# EAGLE design Main Flight Computer (EAGLE 9.0.1)
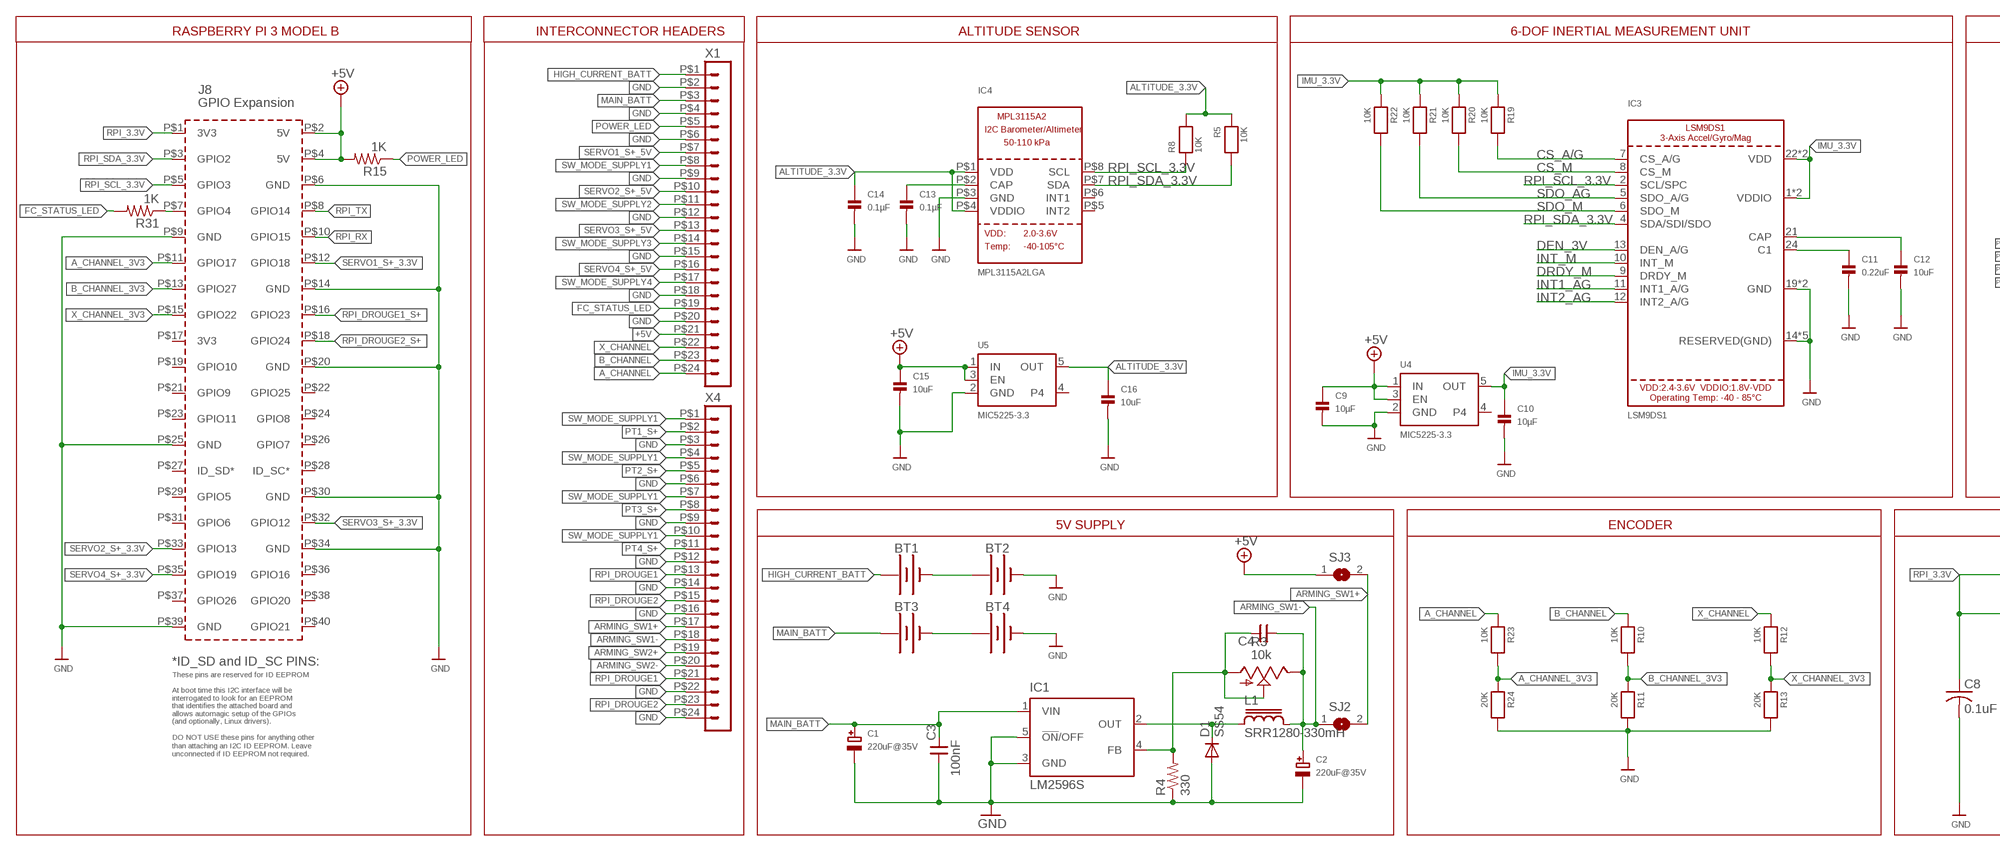
[diagram p0: schematic, sheet 1, part 1 of 2]
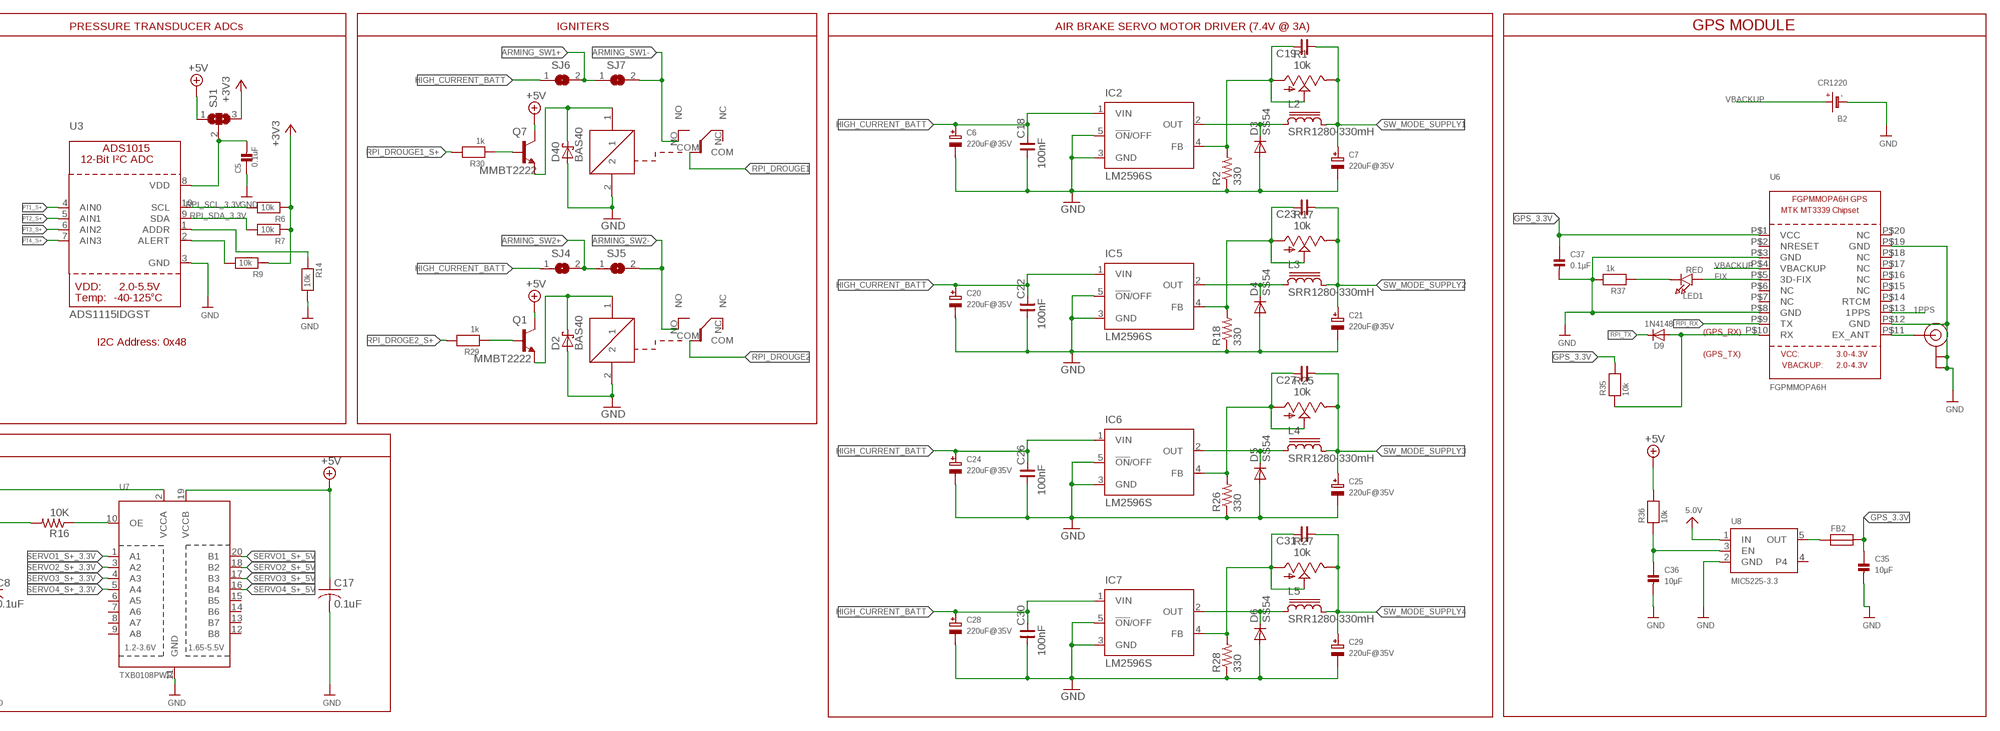
[diagram p1: schematic, sheet 1, part 2 of 2]

## Parts
B2  CR1220  BATTERYCR1220_SMT  [CR1220]
BT1  BATTERY-18650  [BATTERY_18650-HOLDER]
BT2  BATTERY-18650  [BATTERY_18650-HOLDER]
BT3  BATTERY-18650  [BATTERY_18650-HOLDER]
BT4  BATTERY-18650  [BATTERY_18650-HOLDER]
C1  220uF@35V  CAP_ELECTROLYTICPANASONIC_D  [PANASONIC_D]
C2  220uF@35V  CAP_ELECTROLYTICPANASONIC_D  [PANASONIC_D]
C3  100nF  CNP-0603  [0603]
C4  CNP-0603  [0603]
C5  0.1uF  CAP_CERAMIC0805  [0805]
C6  220uF@35V  CAP_ELECTROLYTICPANASONIC_D  [PANASONIC_D]
C7  220uF@35V  CAP_ELECTROLYTICPANASONIC_D  [PANASONIC_D]
C8  0.1uF  C-USC0805  [C0805]
C9  10µF  CAP_CERAMIC0603  [0603]
C10  10µF  CAP_CERAMIC0603  [0603]
C11  0.22uF  CAP_CERAMIC0603  [0603]
C12  10uF  CAP_CERAMIC0603  [0603]
C13  0.1µF  CAP_CERAMIC0603  [0603]
C14  0.1µF  CAP_CERAMIC0603  [0603]
C15  10uF  CAP_CERAMIC0603  [0603]
C16  10uF  CAP_CERAMIC0603  [0603]
C17  0.1uF  C-USC0805  [C0805]
C18  100nF  CNP-0603  [0603]
C19  CNP-0603  [0603]
C20  220uF@35V  CAP_ELECTROLYTICPANASONIC_D  [PANASONIC_D]
C21  220uF@35V  CAP_ELECTROLYTICPANASONIC_D  [PANASONIC_D]
C22  100nF  CNP-0603  [0603]
C23  CNP-0603  [0603]
C24  220uF@35V  CAP_ELECTROLYTICPANASONIC_D  [PANASONIC_D]
C25  220uF@35V  CAP_ELECTROLYTICPANASONIC_D  [PANASONIC_D]
C26  100nF  CNP-0603  [0603]
C27  CNP-0603  [0603]
C28  220uF@35V  CAP_ELECTROLYTICPANASONIC_D  [PANASONIC_D]
C29  220uF@35V  CAP_ELECTROLYTICPANASONIC_D  [PANASONIC_D]
C30  100nF  CNP-0603  [0603]
C31  CNP-0603  [0603]
C35  10µF  CAP_CERAMIC0603  [0603]
C36  10µF  CAP_CERAMIC0603  [0603]
C37  0.1µF  CAP_CERAMIC0603  [0603]
D1  SS54  S3G  [DO214AB]
D2  BAS40  [SOT23]
D3  SS54  S3G  [DO214AB]
D4  SS54  S3G  [DO214AB]
D5  SS54  S3G  [DO214AB]
D6  SS54  S3G  [DO214AB]
D9  1N4148  DIODESOD-323  [SOD-323]
D40  BAS40  [SOT23]
FB2  FERRITE  [0603]
IC1  LM2596S  [TO263-5]
IC2  LM2596S  [TO263-5]
IC3  LSM9DS1  [LGA24_3.5X3.1MM]
IC4  MPL3115A2LGA  [LGA8]
IC5  LM2596S  [TO263-5]
IC6  LM2596S  [TO263-5]
IC7  LM2596S  [TO263-5]
L1  SRR1280-330mH  SRR1280  [SRR1280]
L2  SRR1280-330mH  SRR1280  [SRR1280]
L3  SRR1280-330mH  SRR1280  [SRR1280]
L4  SRR1280-330mH  SRR1280  [SRR1280]
L5  SRR1280-330mH  SRR1280  [SRR1280]
LED1  RED  LED0805  [CHIPLED_0805]
PCB1  RPI3  [RPI3]
Q1  MMBT2222  TRANSISTOR_NPN  [SOT223]
Q7  MMBT2222  TRANSISTOR_NPN  [SOT223]
R1  10k  TRIM_US-S64W  [S64W]
R2  330  R-US_R0603  [R0603]
R3  10k  TRIM_US-S64W  [S64W]
R4  330  R-US_R0603  [R0603]
R5  10K  RESISTOR0603  [0603]
R6  10k  RESISTOR0805  [0805]
R7  10k  RESISTOR0805  [0805]
R8  10K  RESISTOR0603  [0603]
R9  10k  RESISTOR0805  [0805]
R10  10K  RESISTOR0603  [0603]
R11  20K  RESISTOR0603  [0603]
R12  10K  RESISTOR0603  [0603]
R13  20K  RESISTOR0603  [0603]
R14  10k  RESISTOR0805  [0805]
R15  1K  R-US_R0603  [R0603]
R16  10K  R-US_R0805  [R0805]
R17  10k  TRIM_US-S64W  [S64W]
R18  330  R-US_R0603  [R0603]
R19  10K  RESISTOR0603  [0603]
R20  10K  RESISTOR0603  [0603]
R21  10K  RESISTOR0603  [0603]
R22  10K  RESISTOR0603  [0603]
R23  10K  RESISTOR0603  [0603]
R24  20K  RESISTOR0603  [0603]
R25  10k  TRIM_US-S64W  [S64W]
R26  330  R-US_R0603  [R0603]
R27  10k  TRIM_US-S64W  [S64W]
R28  330  R-US_R0603  [R0603]
R29  1k  RESISTOR0603  [0603]
R30  1k  RESISTOR0603  [0603]
R31  1K  R-US_R0603  [R0603]
R35  10k  RESISTOR0603  [0603]
R36  10k  RESISTOR0603  [0603]
R37  1k  RESISTOR0603  [0603]
SJ1  SJ2W  [SJ_2]
SJ2  SJ  [SJ]
SJ3  SJ  [SJ]
SJ4  SJ  [SJ]
SJ5  SJ  [SJ]
SJ6  SJ  [SJ]
SJ7  SJ  [SJ]
U3  ADS1115IDGST  ADC_ADS1015  [MSOP10]
U4  MIC5225-3.3  VREG_SOT23-5  [SOT23-5]
U5  MIC5225-3.3  VREG_SOT23-5  [SOT23-5]
U6  FGPMMOPA6H  GPS_FGPMMOPA6H  [FGPMMOPA6H]
U7  TXB0108PWR  [TSSOP20]
U8  MIC5225-3.3  VREG_SOT23-5  [SOT23-5]
U$2  U.FL  [U.FL]
U$11  RW-SH  [RW-SH]
U$13  RW-SH  [RW-SH]
X1  HEADER_POS24_44914-2401  [44914-2401]
X4  HEADER_POS24_44914-2401  [44914-2401]

## Nets
1PPS: U6.P$13(1PPS)
5.0V: U8.1(IN)
+3V3: R6.1 R7.1 R9.1 SJ1.3
+5V: C9.1 C15.1 C17.1 PCB1.P$2(5V) PCB1.P$4(5V) Q1.2(C) Q7.2(C) R15.2 R36.2 SJ1.1 SJ3.1 U4.1(IN) U4.3(EN) U5.1(IN) U5.3(EN) U7.19(VCCB) X1.P$21
A_CHANNEL: R23.1 X1.P$24
A_CHANNEL_3V3: PCB1.P$11(GPIO17) R23.2 R24.1
ALTITUDE_3.3V: C14.1 C16.1 IC4.P$1(VDD) IC4.P$4(VDDIO) R5.1 R8.2 U5.5(OUT)
ARMING_SW1+: SJ2.2 SJ3.2 SJ6.2 SJ7.1 X4.P$17
ARMING_SW1-: C2.+ C4.1 L1.2 R3.E SJ2.1 SJ7.2 U$11.NO X4.P$18
ARMING_SW2+: SJ4.2 SJ5.1 X4.P$19
ARMING_SW2-: SJ5.2 U$13.NO X4.P$20
B_CHANNEL: R10.1 X1.P$23
B_CHANNEL_3V3: PCB1.P$13(GPIO27) R10.2 R11.1
C2: C11.1 IC3.24(C1)
CAP1: C12.1 IC3.21(CAP)
CAP2: C13.1 IC4.P$2(CAP)
CS_A/G: IC3.7(CS_A/G) R19.2
CS_M: IC3.8(CS_M) R20.2
DEN_3V: IC3.13(DEN_A/G)
DRDY_M: IC3.9(DRDY_M)
FC_STATUS_LED: R31.2 X1.P$19
FIX: LED1.A U6.P$5(3D-FIX)
GND: B2.- BT2.GND@1(-) BT4.GND@1(-) C1.- C2.- C3.1 C5.1 C6.- C7.- C8.2 C9.2 C10.2 C11.2 C12.2 C13.2 C14.2 C15.2 C16.2 C17.2 C18.1 C20.- C21.- C22.1 C24.- C25.- C26.1 C28.- C29.- C30.1 C35.2 C36.2 C37.2 D1.A D2.1(A) D3.A D4.A D5.A D6.A D40.1(A) IC1.3(GND) IC1.5(!ON!/OFF) IC2.3(GND) IC2.5(!ON!/OFF) IC3.14(RESERVED(GND)) IC3.15(RESERVED(GND)) IC3.16(RESERVED(GND)) IC3.17(RESERVED(GND)) IC3.18(RESERVED(GND)) IC3.19(GND) IC3.20(GND) IC4.P$3(GND) IC5.3(GND) IC5.5(!ON!/OFF) IC6.3(GND) IC6.5(!ON!/OFF) IC7.3(GND) IC7.5(!ON!/OFF) PCB1.P$6(GND) PCB1.P$9(GND) PCB1.P$14(GND) PCB1.P$20(GND) PCB1.P$25(GND) PCB1.P$30(GND) PCB1.P$34(GND) PCB1.P$39(GND) R2.1 R4.1 R11.2 R13.2 R14.2 R18.1 R24.2 R26.1 R28.1 R37.2 U3.3(GND) U4.2(GND) U5.2(GND) U6.P$3(GND) U6.P$8(GND) U6.P$12(GND) U6.P$19(GND) U7.11(GND) U8.2(GND) U$2.P$1(GND) U$2.P$2(GND) U$11.2 U$13.2 X1.P$2 X1.P$4 X1.P$6 X1.P$9 X1.P$12 X1.P$15 X1.P$18 X1.P$20 X4.P$3 X4.P$6 X4.P$9 X4.P$12 X4.P$14 X4.P$16 X4.P$22 X4.P$24
GPS_3.3V: C35.1 C37.1 FB2.2 R35.2 U6.P$1(VCC)
HIGH_CURRENT_BATT: BT1.PWR@1(+) C6.+ C18.2 C20.+ C22.2 C24.+ C26.2 C28.+ C30.2 IC2.1(VIN) IC5.1(VIN) IC6.1(VIN) IC7.1(VIN) SJ4.1 SJ6.1 X1.P$1
IMU_3.3V: C10.1 IC3.1(VDDIO) IC3.3(VDDIO) IC3.22(VDD) IC3.23(VDD) R19.1 R20.1 R21.1 R22.1 U4.5(OUT)
INT1_AG: IC3.11(INT1_A/G)
INT2_AG: IC3.12(INT2_A/G)
INT_M: IC3.10(INT_M)
MAIN_BATT: BT3.PWR@1(+) C1.+ C3.2 IC1.1(VIN) X1.P$3
N$1: C5.2 SJ1.2 U3.8(VDD)
N$2: D4.C IC5.2(OUT) L3.1
N$3: D1.C IC1.2(OUT) L1.1
N$4: C4.2 IC1.4(FB) R3.A R3.S R4.2
N$5: C23.2 IC5.4(FB) R17.A R17.S R18.2
N$6: R16.1 U7.10(OE)
N$7: D2.3(C) Q1.3(E) U$13.1
N$8: D3.C IC2.2(OUT) L2.1
N$9: C19.2 IC2.4(FB) R1.A R1.S R2.2
N$10: D5.C IC6.2(OUT) L4.1
N$11: Q1.1(B) R29.1
N$12: Q7.1(B) R30.1
N$13: PCB1.P$7(GPIO4) R31.1
N$16: C27.2 IC6.4(FB) R25.A R25.S R26.2
N$17: D6.C IC7.2(OUT) L5.1
N$18: C31.2 IC7.4(FB) R27.A R27.S R28.2
N$19: BT1.GND@1(-) BT2.PWR@1(+)
N$20: U6.P$11(EX_ANT) U$2.P$3(SIGNAL)
N$21: D9.A R35.1 U6.P$10(RX)
N$23: C36.1 R36.1 U8.3(EN)
N$24: LED1.C R37.1
N$38: R9.2 U3.2(ALERT)
N$41: R14.1 U3.1(ADDR)
N$43: BT3.GND@1(-) BT4.PWR@1(+)
N$128: D40.3(C) Q7.3(E) U$11.1
OUT: FB2.1 U8.5(OUT)
POWER_LED: R15.1 X1.P$5
PT1_S+: U3.4(AIN0) X4.P$2
PT2_S+: U3.5(AIN1) X4.P$5
PT3_S+: U3.6(AIN2) X4.P$8
PT4_S+: U3.7(AIN3) X4.P$11
RPI_3.3V: C8.1 PCB1.P$1(3V3) R16.2 U7.2(VCCA)
RPI_DROGE2_S+: R29.2
RPI_DROUGE1: U$11.COM X4.P$13 X4.P$21
RPI_DROUGE1_S+: PCB1.P$16(GPIO23) R30.2
RPI_DROUGE2: U$13.COM X4.P$15 X4.P$23
RPI_DROUGE2_S+: PCB1.P$18(GPIO24)
RPI_RX: PCB1.P$10(GPIO15) U6.P$9(TX)
RPI_SCL_3.3V: IC3.2(SCL/SPC) IC4.P$8(SCL) PCB1.P$5(GPIO3) R6.2 R8.1 U3.10(SCL)
RPI_SDA_3.3V: IC3.4(SDA/SDI/SDO) IC4.P$7(SDA) PCB1.P$3(GPIO2) R5.2 R7.2 U3.9(SDA)
RPI_TX: D9.C PCB1.P$8(GPIO14)
SDO_AG: IC3.5(SDO_A/G) R21.2
SDO_M: IC3.6(SDO_M) R22.2
SERVO1_S+_3.3V: PCB1.P$12(GPIO18) U7.1(A1)
SERVO1_S+_5V: U7.20(B1) X1.P$7
SERVO2_S+_3.3V: PCB1.P$33(GPIO13) U7.3(A2)
SERVO2_S+_5V: U7.18(B2) X1.P$10
SERVO3_S+_3.3V: PCB1.P$32(GPIO12) U7.4(A3)
SERVO3_S+_5V: U7.17(B3) X1.P$13
SERVO4_S+_3.3V: PCB1.P$35(GPIO19) U7.5(A4)
SERVO4_S+_5V: U7.16(B4) X1.P$16
SW_MODE_SUPPLY1: C7.+ C19.1 L2.2 R1.E X1.P$8 X4.P$1 X4.P$4 X4.P$7 X4.P$10
SW_MODE_SUPPLY2: C21.+ C23.1 L3.2 R17.E X1.P$11
SW_MODE_SUPPLY3: C25.+ C27.1 L4.2 R25.E X1.P$14
SW_MODE_SUPPLY4: C29.+ C31.1 L5.2 R27.E X1.P$17
VBACKUP: B2.+$1(+) B2.+$2(+) U6.P$4(VBACKUP)
X_CHANNEL: R12.1 X1.P$22
X_CHANNEL_3V3: PCB1.P$15(GPIO22) R12.2 R13.1
Unconnected: IC4.P$5(INT2) IC4.P$6(INT1) PCB1.P$17(3V3) PCB1.P$19(GPIO10) PCB1.P$21(GPIO9) PCB1.P$22(GPIO25) PCB1.P$23(GPIO11) PCB1.P$24(GPIO8) PCB1.P$26(GPIO7) PCB1.P$27(ID_SD*) PCB1.P$28(ID_SC*) PCB1.P$29(GPIO5) PCB1.P$31(GPIO6) PCB1.P$36(GPIO16) PCB1.P$37(GPIO26) PCB1.P$38(GPIO20) PCB1.P$40(GPIO21) U4.4 U5.4 U6.P$2(NRESET) U6.P$6(NC) U6.P$7(NC) U6.P$14(RTCM) U6.P$15(NC) U6.P$16(NC) U6.P$17(NC) U6.P$18(NC) U6.P$20(NC) U7.6(A5) U7.7(A6) U7.8(A7) U7.9(A8) U7.12(B8) U7.13(B7) U7.14(B6) U7.15(B5) U8.4 U$11.NC U$13.NC

## Notes on the sheet
- RASPBERRY PI 3 MODEL B | INTERCONNECTOR HEADERS | ALTITUDE SENSOR | 6-DOF INERTIAL MEASUREMENT UNIT | PRESSURE TRANSDUCER ADCs | IGNITERS | AIR BRAKE SERVO MOTOR DRIVER (7.4V @ 3A) | GPS MODULE
- (GPS_RX)
- I2C Address: 0x48
- (GPS_TX)
- 5V SUPPLY | ENCODER

## Library data of the parts
B2 = microbuilder:BATTERY: CR1220 SMT - Digikey: 3001K-ND CD2032 BAT-HLD-001 - Digikey: BAT-HLD-001-ND
BT1-BT4 = SparkFun-Batteries:BATTERY: Battery - Single Cell A variety of battery chemistries, sizes, and footprints. Device List: 20MM_PTH - Coin Cell Battery Holder - 20mm (PTH) <https://www.sparkfun.com/products/783> 6.8MM_PTH - Coin Cell Battery Holder - 6.8MM(SMD) <https://www.digikey.com/product-detail/en/seiko-instruments/MS621FE-FL11E/728-1057-ND/1889208?WT.srch=1&gclid=CNOQ5a6LzdQCFZS2wAodXCkE0g> 12MM_SMD - Coin Cell Battery Holder - 12mm (SMD) <https://www.sparkfun.com/products/10592> 12MM_PTH - Coin Cell Battery Holder - 12mm (PTH) <https://www.sparkfun.com/products/7948> 20MM_SMD - 20mm Coin Cell Battery Holder (SMD) (2 legs) Used on the Big Time Watch Kit <https://www.sparkfun.com/products/11734> 20MM_SMD_4LEGS - Coin Cell Battery Holder - 20mm (SMD) <https://www.sparkfun.com/products/11892> 20MM_SMD_4LEGS_OVERPASTE - Coin Cell Battery Holder - 20mm (SMD) <https://www.sparkfun.com/products/11892> (Over-paste on the legs) 24.5MM_PTH - Coin Cell Battery Holder - 24.5mm (PTH) <https://www.sparkfun.com/products/8863> 9V - 9V Battery Holder - PC Mount Used on the SparkFun SparkPunk Sound Kit <https://www.sparkfun.com/products/11177> and SparkFun SparkPunk Sequencer Kit <https://www.sparkfun.com/products/12707> 18650 - Battery Holder - 18650 (PTH) <https://www.sparkfun.com/products/13113> AA - Battery Holder - 1xAA (PTH) <https://www.sparkfun.com/products/7949> AAA - Battery Holder - 1xAAA (PTH) <https://www.sparkfun.com/products/12718> AA_KIT - Battery Holder - 1xAA (PTH) <https://www.sparkfun.com/products/7949> Special kit package - pads only have exposed copper on one side of the board. AAA_KIT - Battery Holder - 1xAAA (PTH) <https://www.sparkfun.com/products/12718> Special kit package - pads only have exposed copper on one side of the board.; PROD_ID: BATT-12327; SF_SKU: PRT-13113
C1 C2 C6 C7 C20 C21 C24 C25 C28 C29 = microbuilder:CAP_ELECTROLYTIC: Electrolytic Capacitors PANASONIC_C - Size C Panasonic Electrolytic Aluminum Capacitor 47µF 16V 20% Electrolytic Capacitor [Digikey: PCE3890TR-ND] PANASONIC_D - Size D Panasonic Electrolytic Aluminum Capacitor 100µF 25V 20% Electrolytic Capacitor [Digikey: PCE3898TR-ND]
C3 C4 C18 C19 C22 C23 C26 C27 C30 C31 = cap-master:CNP-: NON-POLARIZED CAP
C5 C9-C16 C35-C37 = microbuilder:CAP_CERAMIC: Ceramic Capacitors 0402 - 0402 Surface Mount Capacitors 16pF 50V 5% [Digikey: 445-4899-2-ND] 18pF 50V 5% [Digikey: 490-1281-2-ND] 22pF 50V 5% [Digikey: 490-1283-2-ND] 68pF 50V 5% [Digikey: 490-1289-2-ND] 0.1uF 10V 10% [Digikey: 490-1318-2-ND] 1.0uF 6.3V 10% [Digikey: 490-1320-2-ND] 0603 - 0603 Surface Mount Capacitors 16 pF 50V 5% [Digikey: 445-5051-2-ND] 22 pF 50V [Digikey: PCC220ACVTR-ND] 33 pF 50V 5% [Digikey: 490-1415-1-ND] 56pF 50V 5% [Digikey: 490-1421-1-ND] 220pF 50V 5% [Digikey: 445-1285-1-ND] 680 pF 50V 2200 pF 50V 5% C0G [Digikey: 445-1297-1-ND] 5600 pF 100V 5% X7R [Digikey: 478-3711-1-ND] 0.1 µF 25V 10% [Digikey: PCC2277TR-ND] 0.22 µF 16V 10% X7R [Digikey: 445-1318-1-ND] 1.0 µF 25V 10% [Digikey: 445-5146-2-ND] 0603 - RF Specific 3pF 250V +/-0.1pF RF [Digikey: 712-1347-1-ND] 18 pF 250V 5% [Digikey: 478-3505-1-ND or 712-1322-1-ND] 56 pF 250V 5% C0G RF [Digikey: 490-4867-1-ND] 68 pF 250V RF [Digikey: 490-4868-1-ND] 0805 - 0805 Surface Mount Capacitors 220 pF 250V 2% RF Ceramic Capacitor [Digikey: 712-1398-1-ND] 1000 pF 50V 2% NP0 Ceramic Capacitor [Digikey: 478-3760-1-ND] 0.1 µF 25V 10% Ceramic Capacitor [Digikey: PCC1828TR-ND] 1.0 µF 16V 10% Ceramic Capacitor[Digikey: 490-1691-2-ND] 10.0 µF 10V 10% Ceramic Capacitor[Digikey: 709-1228-1-ND] 10.0 uF 16V 10% Ceramic Capacitor [Digikey: 478-5165-2-ND] 47 uF 6.3V 20% Ceramic Capacitor [Digikey: 587-1779-1-ND or 399-5506-1-ND] 1206 - 1206 Surface Mount Capacitors 47uF 10V 20% Ceramic Capacitor [Digikey: 490-5528-1-ND or 399-5508-1-ND or 445-6010-1-ND]
C8 C17 = adafruit:C-US: CAPACITOR, American symbol
D1 D3-D6 = s3x_10:S3*: S3A - S3N General Purpose Rectifiers Source: http://www.fairchildsemi.com/datasheets/S3/S3A.pdf; MF: Fairchild; MPN: S3G; OC_FARNELL: 2454094; OC_NEWARK: 58K2397
D2 D40 = diode:BAS40: Silicon Schottky Diodes General-purpose diode for high-speed switching
D9 = microbuilder:DIODE: Diode SMA Model Volts Amps Type Vf Ir Digikey # Notes SSA34-E3 40V 3A Schottky 480mV @ 3A 200uA @ 40V SSA34-E3/61TGITR-ND CDBA120-G 20V 1A Schottky 500mV @ 1A 500uA @ 20V 641-1014-6-ND REEL MBRA210 10V 2A Schottky 350mV @ 2A 700uA @ 10V MBRA210LT3 SOD-123 Model Volts Amps Type Vf Ir Order # Notes BAT54T1G 30V 200mA Schottky 800mV @ 200mA 2uA @ 25V BAT54T1GOSTR-ND B0530W 30V 500mA Schottky 430mV @ 500mA 130uA @ 30V B0530W-FDICT-ND REEL MBR120 20V 1A Schottky 340mV @ 1A MBR120VLSFT1GOSCT-ND SOD-323 Model Volts Amps Type Vf Ir Order # Notes PMEG2005EJ 20V 500mA Schottky 355mV @ 500mA 568-4110-1-ND ZLLS410 10V 570mA Schottky 380mV @ 570mA ZLLS410CT-ND 1N4148WS 75V 150mA Silicon/Simple 1V 1N4148WSFSCT-ND REEL SOD-523 Model Volts Amps Type Vf Ir Order # Notes BAT54XV2 30V 200mA Schottky 0.8V @ 100mA BAT54XV2CT-ND TB751S 30V 30mA Schottky RB751S-40TE61CT-ND SOT23-R/W (R = Solder Paste/Reflow Ovens, W = Hand-Soldering) Model Volts Amps Type Vf Ir Order # Notes BAT54FILM 40V 300mA Schottky 497-7162-1-ND POWERDI-5 Model Volts Amps Type Vf Ir Order # Notes PDS560 60V 5A Schottky 670mV @ 5A 150uA @ 60V PDS560DICT-ND
FB2 = microbuilder:FERRITE: Ferrite Bead 0603 MMZ1608B121C - 120 Ohm, 600mA Ferrite Chip - Digikey: 445-2164-1-ND BK1608HW121-T - 120 Ohm, 600mA Ferrite Chip - Digikey: 587-1876-2-ND
IC1 IC2 IC5-IC7 = national-semiconductor:LM2596: SIMPLE SWITCHER® Power Converter 150 kHz 3A Step-Down Voltage Regulator Source: http://www.national.com/ds/LM/LM2596.pdf; MF: NATIONAL SEMICONDUCTOR; MPN: LM2596S-ADJ/NOPB; OC_FARNELL: 9494367; OC_NEWARK: 41K3842
IC3 = microbuilder:LSM9DS1
IC4 = microbuilder:MPL3115A2
L1-L5 = inductor-bourns:SRR1280: POWER INDUCTOR
LED1 = microbuilder:LED: LED 0603 - 0603 Surface Mount Package 2mA: Green LED - Low Power (3.9mcd, 2ma, 1.7Vf) - Digikey: 475-2709-2-ND Orange LED - Low Power (9.8mcd, 2ma, 1.8Vf) - Digikey: 475-1194-2-ND Red LED - Low Power (5mcd, 2ma, 1.8Vf) - Digikey: 475-1195-2-ND Yellow LED - Low Power (7mcd, 2ma, 1.8Vf) - Digikey: 475-1196-2-ND 5mA: Blue LED - Low Power (17mcd, 5ma, 2.9Vf) - Digikey: LNJ937W8CRACT-ND 0805 - 0805 Surface Mount Package 2mA: Red LED (8.8mcd, 2mA, 1.8Vf, Clear) - Low Power [Digikey: 475-2510-1-ND] Green LED (5mcd, 2mA, 1.8Vf, Clear) - Low Power [Digikey: 475-2730-1-ND] Yellow LED (11.3mcd, 2mA, 1.8Vf, Clear) - Low Power [Digikey: 475-2555-1-ND] 20mA: Red LED (104mcd, 20mA, Diffused) - LS R976 [Digikey: 475-1278-6-ND] Red LED (12mcd, 20mA, 2.0Vf, Clear) - APT2012EC [Digikey: 754-1128-1-ND] Green LED (15mcd, 20mA, 2.2Vf, Clear) - APT2012GC [Digikey: 754-1131-1-ND] Orange LED (160mcd, 20mA, 2.1Vf, Clear) - APT2012SECK [Digikey: 754-1130-1-ND] 1206 - 1206 Surface Mount Package Green LED (26mcd, 20mA, Diffused) - LG N971 [Digikey: 475-1407-6-ND] Red LED (15mcd, 20mA, Diffused) - LH N974 [Digikey: 475-1416-6-ND]
PCB1 = e14_Rpi3_RevA:RPI3: Device for Raspberry Pi 3 board created by Dave Young for www.element14.com More information and support community is available at https://www.element14.com/community/community/raspberry-pi
Q1 Q7 = SparkFun:TRANSISTOR_NPN: Transistor NPN BJT configuration in SOT23 package. MMBT2222 is the common NPN we use. Double check BCE configuration again layout.
R1 R3 R17 R25 R27 = pot:TRIM_US-: POTENTIOMETER
R2 R4 R15 R16 R18 R26 R28 R31 = adafruit:R-US_: RESISTOR, American symbol
R5-R14 R19-R24 R29 R30 R35-R37 = microbuilder:RESISTOR: Resistors 0402 - 0402 Surface Mount Package 22 Ohm 1% 1/16W [Digikey: 311-22.0LRTR-ND] 33 Ohm 5% 1/16W 1.0K 5% 1/16W 1.5K 5% 1/16W 2.0K 1% 1/16W 10.0K 1% 1/16W [Digikey: 311-10.0KLRTR-ND] 10.0K 5% 1/16W [Digikey: RMCF0402JT10K0TR-ND] 12.1K 1% 1/16W [Digikey: 311-22.0LRTR-ND] 100.0K 5% 1/16W 0603 - 0603 Surface Mount Package 0 Ohm 1/10 Watt 1% Resistor 15 Ohm 1/10 Watt 1% Resistor 33 Ohm 1/10 Watt 1% Resistor 49.9 Ohm 1/10 Watt 1% Resistor 100 Ohm 1/10 Watt 1% Resistor 150 Ohm 1/10 Watt 1% Resistor 240 Ohm 1/10 Watt 1% Resistor 390 Ohm 1/10 Watt 1% Resistor 560 Ohm 1/10 Watt 1% Resistor 680 Ohm 1/10 Watt 1% Resistor 750 Ohm 1/10 Watt 1% Resistor 1.0K Ohm 1/10 Watt 1% Resistor 1.5K Ohm 1/10 Watt 1% Resistor 2.0K Ohm 1/10 Watt 1% Resistor 2.2K Ohm 1/10 Watt 1% Resistor 3.3K Ohm 1/10 Watt 1% Resistor 4.7K Ohm 1/10 Watt 1% Resistor 10.0K Ohm 1/10 Watt 1% Resistor 12.0K Ohm 1/10 Watt 1% Resistor 12.1K Ohm 1/10 Watt 1% Resistor 20.0K Ohm 1/10 Watt 1% Resistor 33.0K Ohm 1/10 Watt 1% Resistor 100.0K Ohm 1/10 Watt 1% Resistor 0805 - 0805 Surface Mount Package 0 Ohm 1/8 Watt 1% Resistor 33 Ohm 1/8 Watt 1% Resistor 100 Ohm 1/8 Watt 1% Resistor 150 Ohm 1/8 Watt 1% Resistor 200 Ohm 1/8 Watt 1% Resistor 240 Ohm 1/8 Watt 1% Resistor 330 Ohm 1/8 Watt 1% Resistor 390 Ohm 1/8 Watt 1% Resistor 470 Ohm 1/8 Watt 1% Resistor 1.0K Ohm 1/8 Watt 1% Resistor 1.5K Ohm 1/8 Watt 1% Resistor 2.0K Ohm 1/8 Watt 1% Resistor 4.7K Ohm 1/8 Watt 1% Resistor 5.1K Ohm 1/8 Watt 1% Resistor 5.6K Ohm 1/8 Watt 1% Resistor 10.0K Ohm 1/8 Watt 1% Resistor 22.0K Ohm 1/8 Watt 1% Resistor 33.0K Ohm 1/8 Watt 1% Resistor 100K Ohm 1/8 Watt 1% Resistor 1206 - 1206 Surface Mount Package 2012 - 2010 Surface Mount Package 0.11 Ohm 1/2 Watt 1% Resistor - Digikey: RHM.11UCT-ND
SJ1 = jumper:SJ2W: SMD solder JUMPER
SJ2-SJ7 = jumper:SJ: SMD solder JUMPER
U3 = microbuilder:ADC_ADS1015: ADS1015 - 12-bit 4-Channel I2C ADC with Internal PGA VDD: 2.0-5.5V Sampling Rate: 3.3ksps Gain Settings: 2/3, 1, 2, 4, 8, 16 I2C Address: ADDR low = 1001000x, ADDR high = 1001001x Internal Comparator The ADS1015 includes an internal comparator that can be set to output a high-level on ALERT when the conversion results exceeeds a pre-defined upper level, and will deassert itself when the level falls below a pre-defined lower threshold level. It can also be set to windowed mode where the ALERT pin will be asserted if the data exceeds the upper threshold or falls below the lower threshold.
U4 U5 U8 = microbuilder:VREG_SOT23-5: SOT23-5 Fixed Voltage Regulators Part Current Out V Out V In V Dropout θJA (°C/W) TJ (°C) Digikey Part No. ADP121 150mA 3.3V 3.4-5.5V 0.09V @ 150mA -- -- ADP121-AUJZ33R7CT-ND ADP121 150mA 3.0V 3.1-5.5V 0.09V @ 150mA -- -- ADP121-AUJZ30R7CT-ND ADP122 300mA 3.3V 3.4-5.5V 0.085V @ 300mA -- -- ADP122AUJZ-3.3-R7CT-ND ADP1712 300mA 3.3V 3.5-5.5V 0.17V @ 300mA -- -- ADP1712AUJZ-3.3-R7TR-ND AP7311 (Low Cost) 150mA 3.3V 3.5-6V 0.15V @ 150mA -- -- AP7311-33WG-7DICT-ND LD39015M18R 150mA 1.8V 1.9V-5.5V 0.08V @ 100mA -- -- 497-6977-1-ND LP2985A-33DBVR 150mA 3.3V 3.3-16V 0.28V @ 150mA 206 150 296-18479-1-ND MCP1824T-3302E/OT 300mA 3.3V 3.5V-6V 0.2V @ 300mA -- -- MCP1824T-3302E/OTCT-ND MIC5205-2.5YM5 TR 150mA 2.5V 2.7-16V 0.165V @ 150mA -- -- 576-1257-2-ND MIC5205-3.0YM5 TR 150mA 3.0V 3.2V-16V 0.165V @ 150mA -- -- 576-1258-2-ND MIC5205-3.3YM5 TR 150mA 3.3V 3.5V-16V 0.165V @ 150mA -- -- 576-1259-2-ND TPS780330220 150mA 3.3V+2.2V 3.6-5.5V 250mV Max -- -- 296-23332-1-ND TDA3663/N1,135 100mA 3.3V 3.5-45V 0.18V @ 50mA -- -- 568-5343-1-ND Max operating temp can be calculated using θJA, TJ (max junction temperature), and power in watts. Set the "Maximum Ambient Temperature" until it reaches TJ ("Max Junction Temperature"), which is the absolute limit for safe use of the regulator: Heat Sink Temperature Calculator <http://www.daycounter.com/Calculators/Heat-Sink-Temperature-Calculator.phtml> For example, With 12V source into a 3.3V LP2985 and a 30mA load, we are dissipating (12V-3.3V) * 0.03A = 0.261W. With a θJA of 206 °C/W, a TJ of 150°C, and 261mW we can safely use the chip without a heat sink up to 75°C (=147.1°C Junction Temperature).
U6 = microbuilder:GPS_FGPMMOPA6H: GPS Module - MTK MT3339 Chipset, -165dBm sensitivity, 22 channels, 10Hz, auto-select external antenna options
U7 = microbuilder:TXB0108PWR: 8-Bit Bi-Directional Level Shifter 1.2V-3.6V (VCCA) to 1.65V-5.5V (VCCB) bi-directional level shifter with auto direction sensing. Max data rate - VCCA 1.8V: 20Mbps (50ns), VCCA 3.3V: 100Mbps (10ns) Digikey: 296-21527-1-ND
U$2 = microbuilder:U.FL: U.FL Antenna Connector
U$11 U$13 = goodsky1:RW-SH
X1 X4 = con-molex-micro-fit-3_0:HEADER_POS24_?: Molex - Micro-Fit 3.0 Series connector, 3.00mm (0.118") pitch header, 24 positions.

## Net classes
0 default: width 0.152 mm
1 16mil: width 0.254 mm, drill 0.254 mm, clearance 0.127 mm
2 MAIN_PACK: width 0.813 mm
3 32mil: width 0.254 mm, drill 0.254 mm, clearance 0.127 mm

## Board
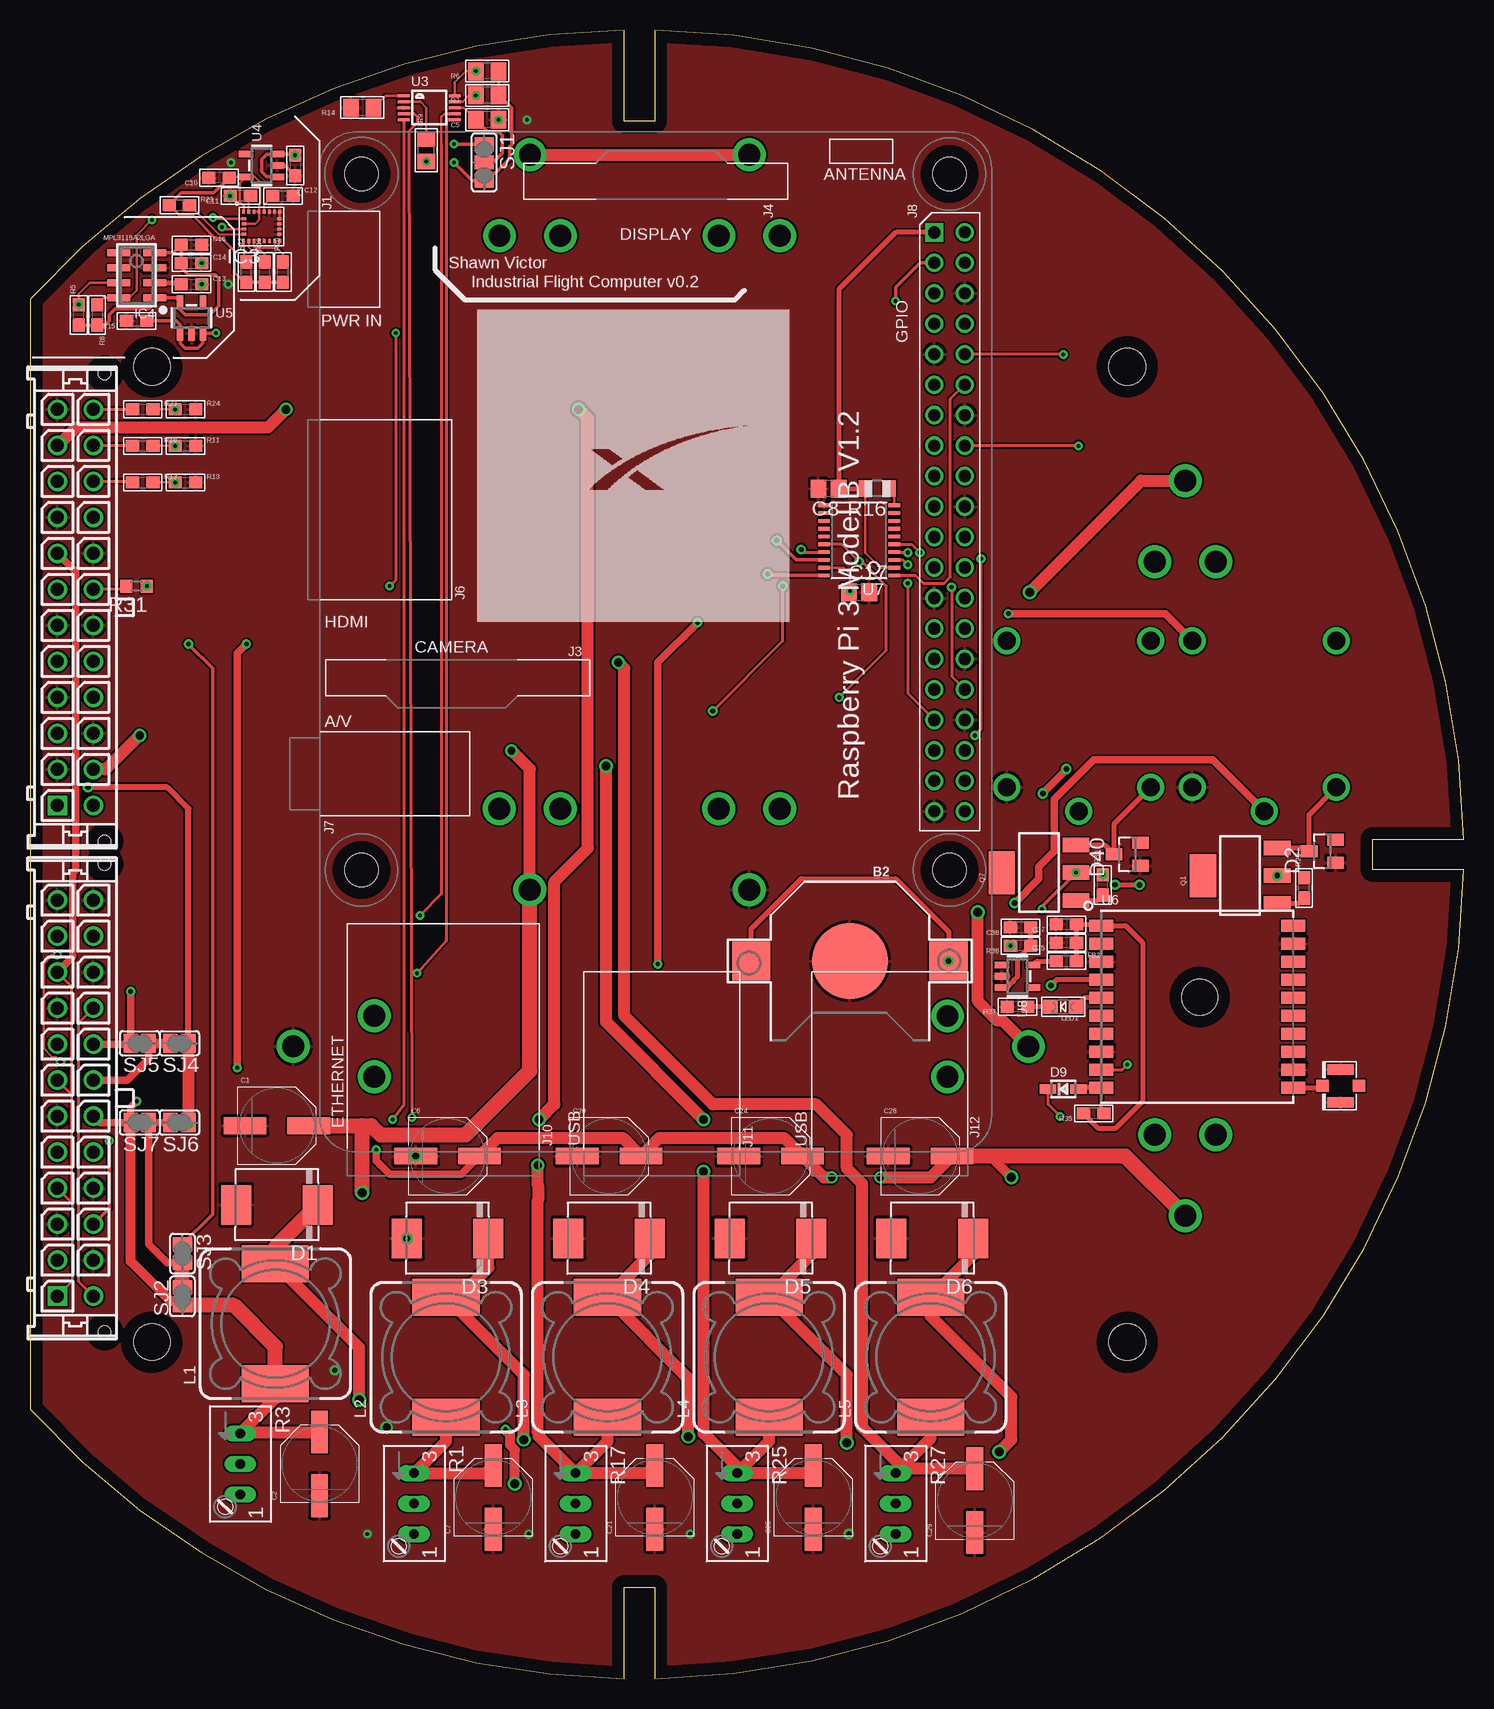
[diagram p2: board, top side]
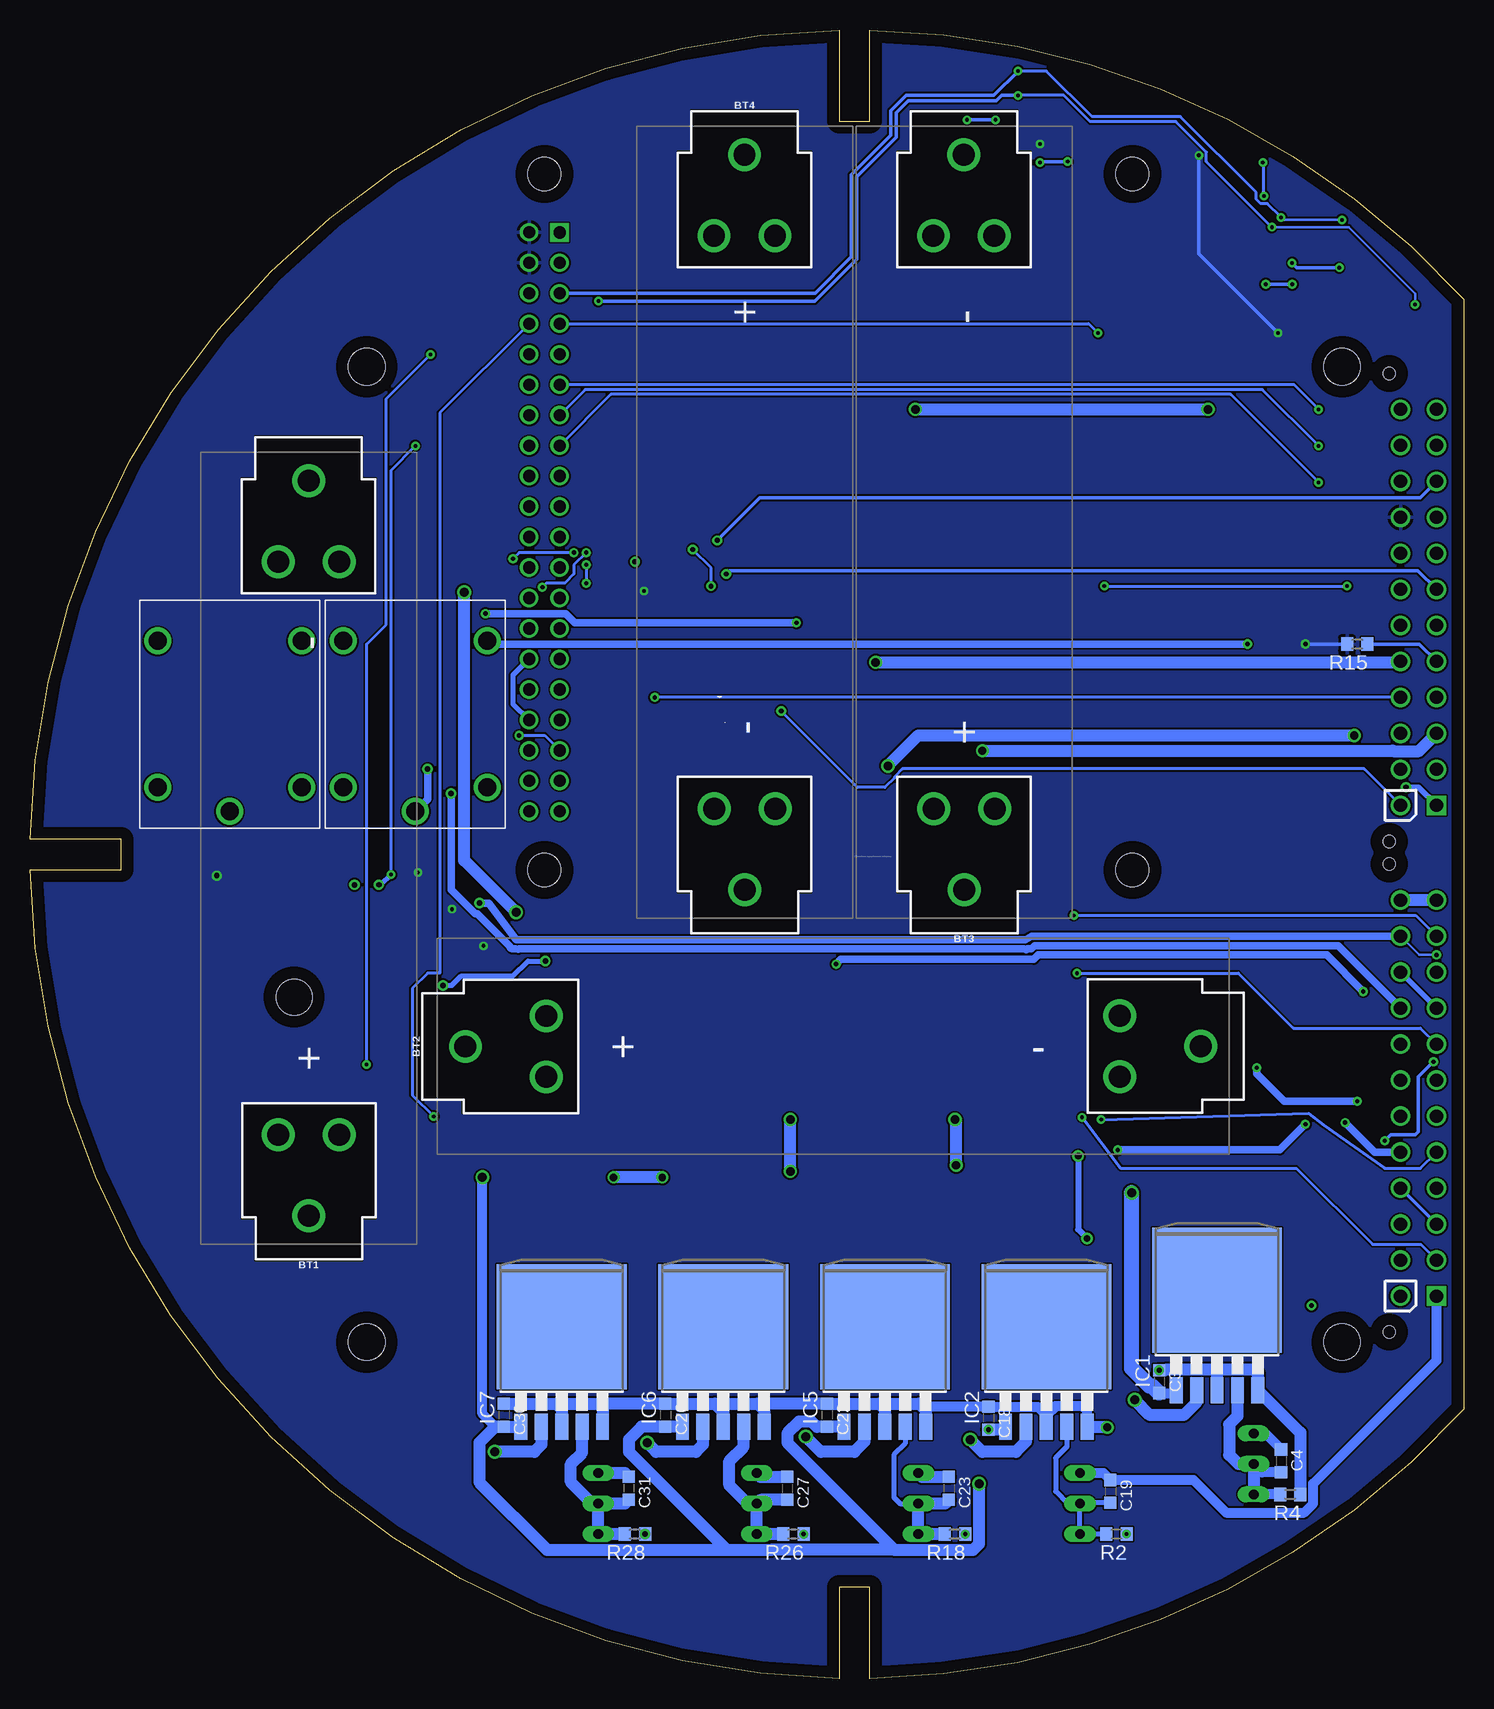
[diagram p3: board, bottom side, seen from below]

Size 119.5 x 137.39 mm. Coordinates in mm from the lower left corner, seen from the top.
Outline: 119.49,69.97 arc88 52.07,137.39
Outline: 52.07,0 arc88 119.49,67.43
Outline: 52.07,0 52.07,7.61 49.53,7.61 49.53,0 arc-47 0,22.44 0,114.96 arc-47 49.53,137.39 49.53,129.78 52.07,129.78 52.07,137.39
Outline: 52.07,0 arc88 119.49,67.43
Outline: 119.49,67.43 111.89,67.43 111.89,69.97 119.49,69.97
Outline: 119.49,69.97 arc88 52.07,137.39
Outline: 119.49,69.97 arc88 52.07,137.39
Outline: 52.07,0 arc88 119.49,67.43
Copper layers (1*16): Top 0.035mm / dielectric 1.5mm / Bottom 0.035mm
Design rules "default": minimum track width 6mil, minimum drill 0.35mm, track to track 6mil, track to pad 6mil, pad to pad 6mil, via to via 6mil, smd to smd 6mil, copper to edge 40mil, drill to drill 6mil, minimum pad ring 10mil, minimum via ring 8mil, stop-mask expansion 4mil, vias tented up to drill 0mil, thermal gap 10mil
Holes 3.05 mm at 10.16,109.34 91.44,109.34 91.44,28.06 10.16,28.06

### Footprints (pad centres in the part's own frame; a part is rotated, then mirrored left to right if it is on the bottom)
CR1220 = smd 3.2 x 3.2: +$1 -8.225,0; +$2 8.225,0 | smd 6.35 x 6.35: - 0,0
BATTERY_18650-HOLDER = drill 1.829: GND@1 30.628,0.01; GND@2 23.88,2.55; GND@3 23.88,-2.53; PWR@1 -30.628,-0.01; PWR@2 -23.88,2.53; PWR@3 -23.88,-2.55
PANASONIC_D = smd 3.556 x 1.4: + 2.654,0; - -2.654,0
0603 = smd 1.016 x 1.016: 1 -0.953,0; 2 0.953,0
0805 = smd 1.3 x 1.5: 1 -0.95,0; 2 0.95,0
C0805 = smd 1.3 x 1.5: 1 -0.85,0; 2 0.85,0
0603' = smd 1.1 x 1: 1 -0.85,0; 2 0.85,0
DO214AB = smd 2.5 x 3.3: A 3.4,0; C -3.4,0
SOT23 = smd 1 x 1.4: 1 -0.95,-1.1; 2 0.95,-1.1; 3 0,1.1
SOD-323 = smd 1.35 x 0.8: A 1.27,0; C -1.27,0
TO263-5 = smd 1.067 x 2.159: 1 -3.404,-5.791; 2 -1.702,-5.791; 3 0,-5.791; 4 1.702,-5.791; 5 3.404,-5.791 | smd 10.8 x 10.41: 6 0,2.54
LGA24_3.5X3.1MM = smd 0.23 x 0.35: 1 -1.505,1.22; 6 -1.505,-1.22; 7 -1.075,-1.22; 8 -0.645,-1.22; 9 -0.215,-1.22; 10 0.215,-1.22; 11 0.645,-1.22; 12 1.075,-1.22; 13 1.505,-1.22; 18 1.505,1.22; 19 1.075,1.22; 20 0.645,1.22; 21 0.215,1.22; 22 -0.215,1.22; 23 -0.645,1.22; 24 -1.075,1.22 | smd 0.35 x 0.23: 2 -1.475,0.645; 3 -1.475,0.215; 4 -1.475,-0.215; 5 -1.475,-0.645; 14 1.475,-0.645; 15 1.475,-0.215; 16 1.475,0.215; 17 1.475,0.645
LGA8 = smd 1.9 x 0.6: P$1 -1.5,1.875; P$2 -1.5,0.625; P$3 -1.5,-0.625; P$4 -1.5,-1.875; P$5 1.5,-1.875; P$6 1.5,-0.625; P$7 1.5,0.625; P$8 1.5,1.875
SRR1280 = smd 5.6 x 3.1: 1 0.635,5; 2 0.635,-5
CHIPLED_0805 = smd 1.2 x 1.2: A 0,-1.05; C 0,1.05
RPI3 = drill 1.016 square: P$1 8.37,51.23 | drill 1.016: P$2 8.357,53.772; P$3 10.897,51.232; P$4 10.897,53.772; P$5 13.437,51.232; P$6 13.437,53.772; P$7 15.977,51.232; P$8 15.977,53.772; P$9 18.517,51.232; P$10 18.517,53.772; P$11 21.057,51.232; P$12 21.057,53.772; P$13 23.597,51.232; P$14 23.597,53.772; P$15 26.137,51.232; P$16 26.137,53.772; P$17 28.677,51.232; P$18 28.677,53.772; P$19 31.217,51.232; P$20 31.217,53.772; P$21 33.757,51.232; P$22 33.757,53.772; P$23 36.297,51.232; P$24 36.297,53.772; P$25 38.837,51.232; P$26 38.837,53.772; P$27 41.377,51.232; P$28 41.377,53.772; P$29 43.917,51.232; P$30 43.917,53.772; P$31 46.457,51.232; P$32 46.457,53.772; P$33 48.997,51.232; P$34 48.997,53.772; P$35 51.537,51.232; P$36 51.537,53.772; P$37 54.077,51.232; P$38 54.077,53.772; P$39 56.617,51.232; P$40 56.617,53.772 | hole 2.75: 3.5,3.5; 61.5,3.5; 3.5,52.5; 61.5,52.5
SOT223 = smd 1.219 x 2.235: 1 -2.311,-3.099; 2 0,-3.099; 3 2.311,-3.099 | smd 3.6 x 2.2: 4 0,3.099
S64W = drill 0.813 long: A 2.54,1.27; E -2.54,1.27; S 0,1.27
R0603 = smd 1 x 1.1: 1 -0.85,0; 2 0.85,0
R0805 = smd 1.1 x 1.4: 1 -1,0; 2 1,0
SJ_2 = smd 1.168 x 1.6: 1 -1.524,0; 2 0,0; 3 1.524,0
SJ = smd 1.168 x 1.6: 1 -0.762,0; 2 0.762,0
MSOP10 = smd 0.25 x 1: 1 -1,-2.113; 2 -0.5,-2.113; 3 0,-2.113; 4 0.5,-2.113; 5 1,-2.113; 6 1,2.113; 7 0.5,2.113; 8 0,2.113; 9 -0.5,2.113; 10 -1,2.113
SOT23-5 = smd 0.55 x 1.2: 1 -0.95,-1.3; 2 0,-1.3; 3 0.95,-1.3; 4 0.95,1.3; 5 -0.95,1.3
FGPMMOPA6H = smd 2 x 1: P$1 -8,6.75; P$2 -8,5.25; P$3 -8,3.75; P$4 -8,2.25; P$5 -8,0.75; P$6 -8,-0.75; P$7 -8,-2.25; P$8 -8,-3.75; P$9 -8,-5.25; P$10 -8,-6.75; P$11 8,-6.75; P$12 8,-5.25; P$13 8,-3.75; P$14 8,-2.25; P$15 8,-0.75; P$16 8,0.75; P$17 8,2.25; P$18 8,3.75; P$19 8,5.25; P$20 8,6.75 | hole 3: 0.2,0.8
TSSOP20 = smd 0.305 x 0.991: 1 -2.925,-2.918; 2 -2.275,-2.918; 3 -1.625,-2.918; 4 -0.975,-2.918; 5 -0.325,-2.918; 6 0.325,-2.918; 7 0.975,-2.918; 8 1.625,-2.918; 9 2.275,-2.918; 10 2.925,-2.918; 11 2.925,2.918; 12 2.275,2.918; 13 1.625,2.918; 14 0.975,2.918; 15 0.325,2.918; 16 -0.325,2.918; 17 -0.975,2.918; 18 -1.625,2.918; 19 -2.275,2.918; 20 -2.925,2.918
U.FL = smd 2.2 x 0.85: P$1 0,1.375; P$2 0,-1.375 | smd 1.05 x 1: P$3 1.525,0; P$4 -1.525,0
RW-SH = drill 1.5: 1 -6.1,6; 2 -6.1,-6; COM -8.1,0; NC 6.1,6; NO 6.1,-6
44914-2401 = drill 1.09 square: P$1 16.5,0 | drill 1.09: P$2 13.5,0; P$3 10.5,0; P$4 7.5,0; P$5 4.5,0; P$6 1.5,0; P$7 -1.5,0; P$8 -4.5,0; P$9 -7.5,0; P$10 -10.5,0; P$11 -13.5,0; P$12 -16.5,0; P$13 16.5,3; P$14 13.5,3; P$15 10.5,3; P$16 7.5,3; P$17 4.5,3; P$18 1.5,3; P$19 -1.5,3; P$20 -4.5,3; P$21 -7.5,3; P$22 -10.5,3; P$23 -13.5,3; P$24 -16.5,3 | hole 1.02: 19.5,3.94; -19.5,3.94

### Placement (x,y rotation side)
B2  68.33,59.81 180 top
BT1  96.27,69.2 90 bottom
BT2  52.58,52.69 0 bottom
BT3  41.66,96.38 90 bottom
BT4  59.94,96.38 270 bottom
C1  20.57,46.09 0 top
C2  24.13,17.9 90 top
C3  25.4,24.75 270 bottom
C4  15.24,18.15 270 bottom
C5  38.1,129.91 180 top
C6  34.8,43.55 0 top
C7  38.61,15.1 90 top
C8  66.55,99.18 180 top
C9  10µF  [0603']  22.1,126.1 270 top
C10  10µF  [0603']  15.75,125.08 180 top
C11  0.22uF  [0603']  17.53,123.56 180 top
C12  10uF  [0603']  21.08,123.56 0 top
C13  0.1µF  [0603']  13.46,116.19 0 top
C14  0.1µF  [0603']  13.46,117.97 0 top
C15  10uF  [0603']  8.89,113.15 180 top
C16  10uF  [0603']  13.46,119.5 0 top
C17  69.09,90.54 0 top
C18  39.62,21.71 270 bottom
C19  29.46,15.61 270 bottom
C20  48.26,43.55 0 top
C21  52.07,15.1 90 top
C22  53.09,21.96 270 bottom
C23  42.93,15.86 270 bottom
C24  61.72,43.55 0 top
C25  65.28,15.1 90 top
C26  66.55,21.96 270 bottom
C27  56.39,15.86 270 bottom
C28  74.17,43.55 0 top
C29  78.74,14.85 90 top
C30  80.01,21.96 270 bottom
C31  69.6,15.86 270 bottom
C35  10µF  [0603']  86.36,61.33 180 top
C36  10µF  [0603']  82.55,62.6 180 top
C37  0.1µF  [0603']  86.36,62.85 180 top
D1  20.57,39.49 180 top
D2  107.7,68.95 90 top
D3  34.8,36.69 180 top
D4  48.26,36.69 180 top
D5  61.72,36.69 180 top
D6  75.18,36.69 180 top
D9  86.11,49.14 0 top
D40  91.44,68.7 90 top
FB2  [0603']  86.36,59.81 0 top
IC1  20.57,29.83 0 bottom
IC2  34.8,26.79 0 bottom
IC3  19.3,121.02 0 top
IC4  8.89,116.96 180 top
IC5  48.26,26.79 0 bottom
IC6  61.72,26.79 0 bottom
IC7  75.18,26.79 0 bottom
L1  19.81,29.58 0 top
L2  34.04,26.79 0 top
L3  47.5,26.79 0 top
L4  60.96,26.79 0 top
L5  74.42,26.79 0 top
LED1  86.11,56 90 top
PCB1  24.13,128.89 270 top
Q1  100.84,66.92 90 top
Q7  84.07,67.17 90 top
R1  30.73,14.59 270 top
R2  28.96,12.05 180 bottom
R3  16.26,17.9 270 top
R4  14.48,15.36 180 bottom
R5  10K  [0603']  4.06,113.65 90 top
R6  38.1,133.97 180 top
R7  38.1,131.94 180 top
R8  10K  [0603']  5.59,113.65 270 top
R9  33.02,127.37 90 top
R10  10K  [0603']  9.4,102.73 0 top
R11  20K  [0603']  12.95,102.73 0 top
R12  10K  [0603']  9.4,99.68 0 top
R13  20K  [0603']  12.95,99.68 0 top
R14  27.69,130.93 180 top
R15  8.89,86.22 180 bottom
R16  70.61,99.18 180 top
R17  44.2,14.59 270 top
R18  42.42,12.05 180 bottom
R19  10K  [0603']  19.56,117.21 90 top
R20  10K  [0603']  21.08,117.21 90 top
R21  10K  [0603']  12.45,122.8 0 top
R22  10K  [0603']  18.03,117.21 90 top
R23  10K  [0603']  9.4,105.78 0 top
R24  20K  [0603']  12.95,105.78 0 top
R25  57.66,14.59 270 top
R26  55.88,12.05 180 bottom
R27  70.87,14.59 270 top
R28  69.09,12.05 180 bottom
R29  1k  [0603']  106.17,65.9 90 top
R30  1k  [0603']  89.41,66.16 90 top
R31  8.89,91.05 180 top
R35  10k  [0603']  88.65,47.11 180 top
R36  10k  [0603']  82.55,61.08 180 top
R37  1k  [0603']  82.3,56 180 top
SJ1  37.85,126.35 270 top
SJ2  12.7,31.87 90 top
SJ3  12.7,35.42 270 top
SJ4  12.45,52.95 180 top
SJ5  9.14,52.95 180 top
SJ6  12.45,46.34 180 top
SJ7  9.14,46.34 180 top
U3  33.27,130.93 270 top
U4  19.3,126.1 90 top
U5  13.46,113.4 0 top
U6  97.28,56 0 top
U7  69.09,94.86 90 top
U8  82.3,58.54 270 top
U$2  109.22,49.39 180 top
U$11  87.38,80.38 90 bottom
U$13  102.87,80.38 90 bottom
X1  2.29,89.27 270 top
X4  2.29,48.38 270 top

### Tracks (layer width: path | path; a pad name or v marks a point on that pad's centre or on a via)
+3V3  (via drill 0.3)
  Top 0.305: v35.33,126.35 36.85,124.83 SJ1.3 38.48,125.46 38.77,125.46 39.99,126.68 39.99,127.7 40.13,127.85 40.13,130.93 39.12,131.94 R7.1 R6.1
  Bottom 0.305: R9.1 35.26,126.42 v35.33,126.35
  other vias: 33.02,126.42
+5V  (via drill 0.3, 0.35, 0.45)
  Top 0.203: U7.19 67.81,92.58 68.33,92.06 v68.33,90.63 C17.1
  Top 0.305: C15.1 12.19,113.15 12.51,112.83 U5.1 12.51,111.3 12.95,110.86 13.97,110.86 14.41,111.3 U5.3 14.44,112.13 v15.49,112.13 | C9.1 22,127.05 U4.3 19.75,127.05 19.3,126.61 19.3,125.59 19.75,125.15 U4.1 | SJ1.1 v35.33,127.88 | SJ3.1 15.24,38.72 15.24,84.19 v13.21,86.22 | Q7.2 84.33,64.33 v84.33,64.12
  Bottom 0.305: v15.49,112.13 22.1,118.73 C9.1 | v13.21,86.22 R15.2
  other vias: 22.1,126.95 87.17,67.17 81.7,61.08 103.94,66.92
  pour Bottom: -15.75,137.02 -15.75,-8.77 129.54,-8.77 129.54,141.34 -11.18,141.34 -15.75,141.34 -15.75,137.28
A_CHANNEL
  Top 0.203: 5.3,105.78 X1.P$24
  Top 0.254: X1.P$24 8.54,105.77 R23.1
A_CHANNEL_3V3  (via drill 0.3)
  Top 0.203: R24.1 R23.2
  Bottom 0.254: R24.1 14.16,107.84 PCB1.P$11
  other vias: 12.1,105.78
ALTITUDE_3.3V
  Top 0.305: IC4.P$4 11.95,118.83 C16.1 C14.1 12.61,117.59 13.21,117 15.45,117 15.75,116.7 15.75,114.42 14.99,113.65 12.95,113.65 12.51,114.1 U5.5 12.13,115.08 IC4.P$1 10.39,114.65 9.91,114.16 7.11,114.16 6.6,113.65 6.6,113.15 6.26,112.8 R8.2 R5.1
ARMING_SW1+  (via drill 0.35)
  Top 0.61: SJ6.2 SJ7.1 9.91,36.18 11.43,34.66 SJ3.2
  Top 1.27: SJ2.2 SJ3.2
  Bottom 0.61: X4.P$17 7.44,43.88 SJ7.1
  other vias: 9.91,46.34
ARMING_SW1-  (via drill 0.35, 0.4)
  Top 0.61: X4.P$18 5.82,46.34 SJ7.2 8.38,47.61 v8.89,48.12 | v17.27,50.92 17.27,85.46 v18.03,86.22
  Top 0.813: SJ2.1 12.37,31.43 11.72,31.43 8.38,34.77 SJ7.2
  Top 1.016: L1.2 20.45,23.36 R3.E 17.64,20.55 C2.+
  Top 1.27: L1.2 20.45,27.67 17.02,31.1 SJ2.1
  Bottom 0.61: v8.89,48.12 14.99,48.12 17.27,50.41 v17.27,50.92 | U$11.NO 81.12,86.22 v18.03,86.22
  Bottom 0.813: C4.1 16.57,20.44 R3.E
  other vias: 12.7,31.1
ARMING_SW2+
  Top 0.61: X4.P$19 8.1,49.88 9.91,51.68 SJ5.1
  Top 0.813: SJ5.1 SJ4.2
ARMING_SW2-  (via drill 0.35)
  Top 0.61: X4.P$20 8.31,52.88 SJ5.2 v8.38,57.27 | v52.32,59.55 52.32,84.7 v55.63,88 | v81.53,88.76 94.59,88.76 U$13.NO
  Bottom 0.61: v8.38,57.27 11.43,60.31 35.47,60.31 35.84,59.94 51.93,59.94 v52.32,59.55 | v55.63,88 74.12,88 74.86,88.74 81.51,88.74 v81.53,88.76
B_CHANNEL
  Top 0.203: 5.32,102.73 X1.P$23
  Top 0.254: X1.P$23 8.51,102.77 R10.1
B_CHANNEL_3V3  (via drill 0.3)
  Top 0.203: R11.1 R10.2
  Bottom 0.254: R11.1 16.8,107.43 73.23,107.43 PCB1.P$13
  other vias: 12.1,102.73
C2
  Top 0.152: IC3.24 18.23,123.41 C11.1
CAP1
  Top 0.152: IC3.21 19.52,122.85 C12.1
CAP2
  Top 0.406: IC4.P$2 12.47,116.33 C13.1
CS_A/G
  Top 0.152: IC3.7 18.23,119.3 18.59,118.94 19.3,118.94 19.56,118.68 R19.2
CS_M
  Top 0.152: IC3.8 18.66,119.38 18.8,119.24 20.57,119.24 21.08,118.73 R20.2
FC_STATUS_LED
  Top 0.254: R31.2 7.76,90.77 X1.P$19
FIX
  Top 0.406: U6.P$5 87.91,56.75 LED1.A
GND  (via drill 0.3, 0.35, 0.4, 0.45, 0.55, 0.65)
  Top 0.203: IC3.17 20.81,121.69 IC3.18
  Top 0.305: U4.2 21.25,126.1 C9.2
  Bottom 0.254: C11.2 16.68,126.27 v16.76,126.35
  Bottom 0.305: C5.1 v41.4,129.91 | C13.2 v16.51,116.19 | IC4.P$3 13.92,117.58 C14.2 | X4.P$3 X4.P$16
  Bottom 0.406: X4.P$9 X4.P$22 | PCB1.P$30 79.25,83.63 79.25,81.24 PCB1.P$34
  Bottom 0.508: C6.- 32.14,37.44 D3.A
  Bottom 0.813: IC2.5 31.39,22.37 31.75,22.72 34.04,22.72 34.8,21.96 | 34.8,21.96 IC2.3 | 34.8,21.96 35.5,22.66 C18.1 45.15,22.66 45.4,22.91
  Bottom 1.016: IC1.3 20.57,25.52 | 20.57,25.52 20.31,25.78 18.06,25.78 18.05,25.77 17.53,25.77 17.17,25.41 IC1.5 13.63,20.5 R4.1 | IC2.5 29.77,20.99 v29.72,20.94 | C30.1 75.63,22.91 | IC7.3 75.18,22.47 75.63,22.91 | 75.63,22.91 72.07,22.91 | IC7.5 71.78,22.62 72.07,22.91 | 62.42,22.91 C26.1 72.07,22.91 | 62.42,22.91 61.72,22.21 IC6.3 | 62.42,22.91 58.86,22.91 | IC6.5 58.32,22.37 58.86,22.91 | 48.7,22.91 C22.1 58.86,22.91 | 48.7,22.91 48.26,22.47 IC5.3 | 48.7,22.91 45.4,22.91 44.86,22.37 IC5.5 | C18.1 39.92,22.66 | C3.1 24.86,25.71 24.78,25.78 20.84,25.78 20.57,25.52 | X4.P$12 X4.P$24
  other vias: 16.68,123.56 39.05,129.91 28.11,12.05 25.4,25.71 41.57,12.05 55.03,12.05 68.24,12.05 32.14,43.55 31.4,36.69 14.31,116.19 10.39,117.58 14.31,117.97
  pour Top: -17.02,-5.73 134.87,-5.73 134.87,139.82 -17.02,139.82
GPS_3.3V
  Top 0.406: FB2.2 C35.1 C37.1 89.17,62.85 U6.P$1 91.29,62.75 92.71,61.33 92.71,48.12 90.42,45.84 89.07,45.84 R35.2
HIGH_CURRENT_BATT  (via drill 0.35, 0.4, 0.45, 0.6, 0.75)
  Top 0.508: SJ4.1 13.21,72.51 11.43,74.28 v4.83,74.28
  Top 0.61: SJ6.1 v13.21,46.19 | v28.85,44.07 28.85,43.15 29.97,42.03 35.93,42.03 C6.+
  Top 0.813: v40.41,16.25 40.41,19.06 40.01,19.46 40.01,20.37 C18.2 | v81.79,41.77 80.01,43.55 78.49,43.55
  Top 1.016: C6.+ 38.98,45.07 49.39,45.07 C20.+ 52.44,45.07 62.85,45.07 C24.+ 66.15,41.77 v66.8,41.77 | SJ4.1 SJ6.1 | v70.87,41.77 75.04,41.77 C28.+
  Top 1.27: BT1.PWR@1 91.28,43.55 78.49,43.55 C28.+
  Bottom 0.508: v4.83,74.28 3.8,74.28 X1.P$1
  Bottom 0.61: v13.21,46.19 15.34,44.07 v28.85,44.07
  Bottom 0.813: 80.71,21.01 81.79,22.09 v81.79,41.77
  Bottom 1.016: IC2.1 38.44,20.75 C18.2 39.67,20.75 | IC7.1 80,20.99 C30.2 80.71,21.01 82.04,19.67 82.04,16.37 76.4,10.73 61.42,10.73 | C22.2 53.07,20.99 IC5.1 53.92,20.99 54.35,21.42 55.4,21.42 56.39,20.44 56.39,19.67 47.5,10.78 | v40.41,16.25 40.41,11.23 40.91,10.73 47.45,10.73 47.5,10.78 | 61.42,10.73 57.72,10.73 57.67,10.78 47.5,10.78 | 61.42,10.73 69.6,18.91 69.6,19.93 68.52,21.01 C26.2 65.14,21.01 IC6.1 | v66.8,41.77 v70.87,41.77
  other vias: 39.62,20.75
IMU_3.3V
  Top 0.152: IC3.22 IC3.23
  Top 0.203: IC3.1 17.8,122.73 17.48,123.05 17.48,124.63 U4.5 | U4.5 16.66,125.15 C10.1 | U4.5 18.73,125.15 19.18,124.7 19.18,122.95 19.09,122.86 IC3.22 19.09,121.57 18.76,121.23 IC3.3
  Top 0.254: R21.1 12.38,122.02 13.46,122.02 15.48,120 16,120 17.02,118.99 17.02,117.21 17.87,116.36 R22.1
  Top 0.305: R21.1 12.61,123.81 15.33,123.81 C10.1 | R22.1 R19.1 R20.1
MAIN_BATT  (via drill 0.65, 0.75)
  Top 1.016: BT3.PWR@1 41.65,75.82 v40.13,77.33
  Top 1.27: C1.+ 27.69,46.09 | 27.69,46.09 28.45,46.09 29.21,45.33 36.32,45.33 41.66,50.66 41.66,65.74 BT3.PWR@1 | v27.69,40.5 27.69,46.09
  Bottom 0.813: C3.2 24.22,23.8 IC1.1
  Bottom 1.016: v40.13,77.33 5.94,77.33 5.9,77.29 3.76,77.29 X1.P$3
  Bottom 1.27: C3.2 26.01,24.41 26.23,24.41 27.69,25.86 v27.69,40.5
N$1
  Top 0.203: U3.8 36.13,130.93 C5.2
  Top 0.305: C5.2 38.2,128.85 39.12,128.85 39.37,128.6 39.37,127.12 38.61,126.35 SJ1.2
N$2  (via drill 0.75)
  Top 1.016: D4.C 51.66,35.31 L3.1 54.86,25.05 v54.86,20.18
  Bottom 1.016: IC5.2 49.96,19.75 50.8,18.91 53.59,18.91 v54.86,20.18
N$3  (via drill 0.75)
  Top 1.016: v27.43,23.23 27.43,27.59 L1.1
  Top 1.27: D1.C 20.45,35.96 L1.1
  Bottom 1.016: IC1.2 22.28,23.05 23.37,21.96 26.16,21.96 v27.43,23.23
N$4
  Bottom 0.813: R4.2 R3.A | C4.2 16.83,17.2 R3.S
  Bottom 1.016: IC1.4 18.87,21.88 19.56,21.2 19.56,18.66 18.8,17.9 R3.S R3.A
N$5
  Bottom 0.406: IC5.4 46.56,19.6 47.5,18.66 47.5,15.1 46.99,14.59 R17.S
  Bottom 1.016: R18.2 R17.A R17.S 43.24,14.59 C23.2
N$6
  Top 0.203: U7.10 72.01,98.78 R16.1
N$7
  Top 0.406: Q1.3 106.32,69.23 D2.3 106.6,72.01 U$13.1
N$8  (via drill 0.75)
  Top 1.016: v41.15,19.93 41.15,25.31 L2.1 35.73,31.79 38.2,34.25 D3.C
  Bottom 1.016: IC2.2 36.5,19.75 37.34,18.91 40.13,18.91 v41.15,19.93
N$9
  Bottom 0.406: R2.2 R1.A R1.S 31.94,14.66 | C19.2 31.94,14.66 | IC2.4 33.1,19.34 34.04,18.4 34.04,15.61 33.02,14.59 32.96,14.66 31.94,14.66
N$10  (via drill 0.75)
  Top 1.016: D5.C 65.12,35.31 L4.1 68.07,25.31 v68.07,19.67
  Bottom 1.016: IC6.2 63.42,19.5 64.01,18.91 67.31,18.91 v68.07,19.67
N$11
  Top 0.406: Q1.1 105.73,64.61 R29.1
N$12
  Top 0.406: Q7.1 88.96,64.86 R30.1
N$13  (via drill 0.3)
  Top 0.254: v30.48,112.13 30.48,91.56 v29.97,91.05
  Bottom 0.254: PCB1.P$7 31.27,112.92 v30.48,112.13 | v29.97,91.05 R31.1
  other vias: 9.74,91.05
N$16
  Bottom 1.016: R26.2 R25.A R25.S | C27.2 58.61,14.91 R25.S | R25.S 59.69,14.59 61.21,16.12 61.21,18.15 60.02,19.34 IC6.4
N$17  (via drill 0.75)
  Top 1.016: D6.C 78.58,35.31 L5.1 75.06,30.21 81.79,23.48 81.79,19.93 v80.77,18.91
  Bottom 1.016: IC7.2 76.89,19.5 77.47,18.91 v80.77,18.91
N$18
  Bottom 1.016: R27.S R27.A R28.2 | R27.S 72.64,14.59 74.42,16.37 74.42,17.9 73.48,18.84 IC7.4 | C31.2 69.91,14.59 R27.S
N$19  (via drill 0.75)
  Top 1.016: BT2.PWR@1 81.05,54.84 80.62,54.84 78.99,56.46 v78.99,63.87 | v83.31,90.54 92.6,99.83 BT1.GND@1
  Bottom 1.016: v78.99,63.87 83.31,68.19 v83.31,90.54
N$20
  Top 0.406: U6.P$11 107.55,49.25 U$2.P$3
N$21
  Top 0.254: R35.1 89.28,47.32 U6.P$10
  Top 0.406: U6.P$10 87.48,49.25 D9.A
N$23
  Top 0.406: U8.3 81.42,57.59 81.95,58.11 81.95,58.19 82.3,58.54 82.3,59.97 R36.1 C36.1
N$24
  Top 0.406: LED1.C R37.1
N$38
  Top 0.203: R9.2 33.02,130.93 32.51,131.43 32.5,131.43 U3.2
N$41
  Top 0.203: R14.1 29.64,131.93 U3.1
N$43
  Top 1.016: BT3.GND@1 BT4.PWR@1
N$128
  Top 0.406: Q7.3 89.55,69.48 D40.3 90.34,71.24 U$11.1
OUT
  Top 0.406: U8.5 83.92,59.81 FB2.1
POWER_LED
  Bottom 0.305: X1.P$5 3.74,86.22 R15.1
PT1_S+  (via drill 0.3)
  Top 0.254: U3.4 32,130.42 32.26,130.16 32.26,129.66 31.57,128.96 31.82,47.04 v31.82,46.79
  Bottom 0.254: v31.82,46.79 28.58,42.53 13.97,42.53 7.62,36.18 3.59,36.18 X4.P$2
PT2_S+  (via drill 0.3)
  Top 0.254: U3.5 31.16,47.79 v30.23,46.6
  Bottom 0.254: v30.23,46.6 12.95,47.11 11.66,46.12 6.6,42.53 3.63,42.53 X4.P$5
PT3_S+  (via drill 0.3)
  Top 0.254: U3.6 34.81,129.93 34.67,129.78 34.67,128.07 34.7,128.05 34.7,61.48 v32.26,58.79
  Bottom 0.254: v32.26,58.79 18.8,58.79 14.22,54.22 3.63,54.22 X4.P$8
PT4_S+  (via drill 0.3)
  Top 0.203: U3.7 34.54,130.42 34.29,130.16 34.29,127.88
  Top 0.254: 34.29,127.88 34.29,65.39 v32.51,63.62
  Bottom 0.254: v32.51,63.62 4.03,63.62 X4.P$11
RPI_3.3V
  Top 0.203: R16.2 69.61,93.83 70.87,92.57 70.88,92.58 U7.2
  Top 0.406: PCB1.P$1 72.15,120.52 67.4,115.77 C8.1 R16.2
RPI_DROUGE1  (via drill 0.45)
  Top 0.254: X4.P$13 4.06,33.1 4.06,54.65 X4.P$21
  Top 0.61: v84.4,73.78 86.36,75.73 v86.36,75.81
  Bottom 0.61: X4.P$21 10.49,61.08 35.78,61.08 36.04,60.82 36.38,60.82 36.49,60.76 36.69,60.82 78.74,60.82 78.79,60.78 79.05,60.82 79.31,60.82 79.35,60.87 79.41,60.87 79.57,61.08 82.23,63.75 82.41,63.75 84.4,65.74 v84.4,73.78 | v86.36,75.81 86.36,73.3 U$11.COM
RPI_DROUGE1_S+  (via drill 0.3, 0.45)
  Top 0.254: v87.38,102.73 87.35,102.76 PCB1.P$16
  Top 0.406: v90.43,66.16 v92.45,66.16 v92.46,66.16
  Bottom 0.254: R30.2 89.41,100.7 v87.38,102.73
  Bottom 0.406: R30.2 90.25,66.16 v90.43,66.16
  other vias: 89.41,67.01
RPI_DROUGE2  (via drill 0.35, 0.45)
  Top 0.203: v2.54,51.42 2.16,51.8 1.84,51.8 1.13,52.52 1.13,59.55 1.78,60.2 1.78,60.31 v2.29,60.31
  Top 0.305: X4.P$15 6.6,39.19 v6.6,44.82
  Top 0.61: v82.04,64.63 84.07,66.66 84.07,67.68 85.34,68.95 85.34,73.27 88.65,76.57 98.58,76.57 U$13.COM
  Bottom 0.203: v2.29,60.31 3.72,60.31 X4.P$23
  Bottom 0.305: v6.6,44.82 6.1,45.33 4.06,45.33 3.81,45.58 3.81,50.15 v2.54,51.42
  Bottom 0.61: X4.P$23 36.03,61.88 36.58,61.58 78.99,61.58 81.28,64.63 v82.04,64.63
RPI_RX  (via drill 0.3)
  Top 0.254: U6.P$9 91.02,50.75 v91.44,51.17 | v86.11,110.35 86.08,110.38 PCB1.P$10
  Bottom 0.254: v91.44,51.17 91.44,86.22 89.81,87.85 89.81,106.64 v86.11,110.35
RPI_SCL_3.3V  (via drill 0.3)
  Top 0.203: R8.1 6.16,115.08 IC4.P$8 8.28,115.08 8.89,115.69 8.89,120.29 v10.16,121.56 | IC3.2 15.36,121.66 v15.24,121.78 | U3.10 35.39,133.04 36.32,133.97 R6.2
  Bottom 0.203: v10.16,121.56 15.02,121.56 v15.24,121.78
  Bottom 0.254: v15.24,121.78 16.38,122.93 16.94,122.93 17.31,123.3 17.31,123.85 23.62,130.16 30.99,130.16 34.8,133.97 R6.2
  Bottom 0.305: R6.2 39.18,131.94 46.48,131.94 47.75,130.67 47.75,128.64 51.05,125.34 51.05,118.48 54.08,115.46 PCB1.P$5
  other vias: 37.15,133.97
RPI_SDA_3.3V  (via drill 0.3)
  Top 0.203: R5.2 4.06,115.43 4.96,116.33 IC4.P$7 | v16,120.96 16.15,120.8 IC3.4 | U3.9 36.06,131.43 36.58,131.94 R7.2
  Top 0.305: v72.14,114.8 72.14,115.94 74.19,118 PCB1.P$3
  Bottom 0.203: R5.2 4.06,115.43 9.59,120.96 v16,120.96
  Bottom 0.254: R7.2 33.34,131.94 31.16,129.76 24.01,129.76 21.46,127.21 21.46,126.42 v16,120.96
  Bottom 0.305: R7.2 38.53,131.94 38.99,131.48 46.29,131.48 47.29,130.48 47.29,128.45 50.6,125.15 50.6,118.29 54.09,114.8 v72.14,114.8
  other vias: 4.06,114.5 37.15,131.94
RPI_TX  (via drill 0.3)
  Top 0.254: v85.85,46.85 84.84,47.87 D9.C
  Bottom 0.254: PCB1.P$8 85.34,105.47 85.34,58.79 86.36,58.79 87.63,57.52 87.63,48.63 v85.85,46.85
SDO_AG
  Top 0.152: R21.2 15.72,120.37 IC3.5
SDO_M
  Top 0.152: IC3.6 17.8,118.29 R22.2
SERVO1_S+_3.3V
  Top 0.254: U7.1 73.79,91.93 74.42,91.3 76.2,91.3 76.71,91.81 76.71,106.64 PCB1.P$12
SERVO1_S+_5V  (via drill 0.4)
  Top 0.305: v61.47,92.06 61.6,91.93 U7.20
  Bottom 0.305: X1.P$7 3.83,92.32 61.21,92.32 v61.47,92.06
SERVO2_S+_3.3V  (via drill 0.35)
  Top 0.254: U7.3 72.75,93.23 v73.15,92.83 | v73.15,91.27 73.15,82.11 PCB1.P$33
  Bottom 0.254: v73.15,92.83 v73.15,91.27
SERVO2_S+_5V  (via drill 0.4)
  Top 0.305: v62.23,94.86 63.85,93.23 U7.18
  Bottom 0.305: X1.P$10 3.64,98.41 58.67,98.41 v62.23,94.86
SERVO3_S+_3.3V  (via drill 0.35)
  Top 0.254: U7.4 73.11,93.88 v73.15,93.84 | v76.79,90.96 76.79,83.55 PCB1.P$32
  Bottom 0.254: v73.15,93.84 74.17,92.83 74.17,92.06 74.93,91.3 76.45,91.3 v76.79,90.96
SERVO3_S+_5V  (via drill 0.4)
  Top 0.254: v56.9,80.63 62.74,86.48 v62.74,91.05 | v64.26,94.1 64.47,93.88 U7.17
  Bottom 0.254: X1.P$13 8.32,75.81 46.8,75.81 47.45,75.16 47.45,75.1 48.26,74.28 50.55,74.28 v56.9,80.63 | v62.74,91.05 62.74,92.57 v64.26,94.1
SERVO4_S+_3.3V  (via drill 0.35)
  Top 0.254: U7.5 73.48,94.53 v74.17,93.84 | v79.25,93.33 79.25,79.11 v78.74,78.6
  Bottom 0.254: v74.17,93.84 78.74,93.84 v79.25,93.33 | v78.74,78.6 76.61,78.6 PCB1.P$35
SERVO4_S+_5V  (via drill 0.35, 0.4)
  Top 0.254: U7.16 67.63,94.53 v69.09,93.08 69.34,93.08 71.37,91.05 71.37,85.71 v67.43,81.77
  Bottom 0.254: X1.P$16 v67.43,81.77
SW_MODE_SUPPLY1
  Top 0.254: X4.P$1 3.56,33.15 3.56,39.61 3.49,39.67 | 3.49,39.67 X4.P$4 | 3.49,39.67 3.49,48.67 | 3.49,48.67 X4.P$7 | 3.49,48.67 3.49,57.67 X4.P$10
  Top 0.61: X4.P$10 3.56,60.15 3.56,65.4 3.56,65.41 3.56,67.17 3.81,67.43 3.81,92.25 X1.P$8
  Top 1.016: L2.2 34.67,19.8 R1.E 37.99,17.13 C7.+
  Bottom 0.813: R1.E 30.03,17.13 C19.1 22.54,16.56 19.81,13.83 13.31,13.83 12.56,14.58 12.56,16.26 2.29,26.53 X4.P$1
SW_MODE_SUPPLY2  (via drill 0.7)
  Top 0.305: X1.P$11 2.3,102.75
  Top 1.016: C21.+ 51.45,17.13 R17.E | R17.E 48.13,19.8 L3.2 | R17.E 42.39,20.21 42.39,20.44 42.32,20.51 42.32,39.92 42.39,39.99 42.39,41.01 42.32,41.08 v42.32,42.79 | v42.42,46.6 43.69,47.87 43.69,66.41 46.48,69.2 46.48,105.02 v45.72,105.78 | v21.34,105.78 19.81,104.26 3.81,104.26 2.3,102.75
  Bottom 1.016: R17.E 45.15,16.82 C23.1 | v42.32,42.79 42.32,46.5 v42.42,46.6 | v45.72,105.78 v21.34,105.78
SW_MODE_SUPPLY3  (via drill 0.7)
  Top 1.016: R25.E 61.59,19.8 L4.2 | C25.+ 64.66,17.13 R25.E | R25.E 58.93,17.64 56.13,20.44 v56.13,42.28 | v56.13,46.6 48.01,54.73 v48.01,76.06 | v9.14,78.6 6.31,75.77 X1.P$14
  Bottom 1.016: R25.E 58.61,16.82 C27.1 | v56.13,42.28 v56.13,46.6 | v48.01,76.06 45.47,78.6 v9.14,78.6
SW_MODE_SUPPLY4  (via drill 0.7)
  Top 1.016: 72.5,17.5 75.06,20.05 L5.2 | C29.+ 72.5,17.5 | 72.5,17.5 R27.E | 72.5,17.5 72.5,17.78 69.34,20.94 69.34,41.26 68.07,42.53 68.07,45.33 65.53,47.87 56.9,47.87 49.53,55.23 49.53,84.19 v49.02,84.7
  Bottom 1.016: C31.1 69.91,17.13 R27.E | v49.02,84.7 5.36,84.7 X1.P$17
VBACKUP  (via drill 0.45)
  Top 0.406: U6.P$4 85.56,58.25 v85.09,57.77 | B2.+$2 60.1,62.5 64.26,66.66 72.14,66.66 76.55,62.25 B2.+$1
  Bottom 0.406: v85.09,57.77 84.34,57.77 83.55,58.56 79.25,58.56 78,59.81 B2.+$1
  other vias: 76.55,59.81
X_CHANNEL
  Top 0.203: 5.37,99.68 X1.P$22
  Top 0.254: X1.P$22 8.46,99.77 R12.1
X_CHANNEL_3V3  (via drill 0.3)
  Top 0.203: R13.1 R12.2
  Bottom 0.254: R13.1 19.44,107.02 71.09,107.02 PCB1.P$15
  other vias: 12.1,99.68

### Text on the board
tPlace: Shawn Victor | Industrial Flight Computer v0.2
bPlace: C:/Users/Shawn-Laptop/Pictures/rH_k3PtQ.bmp